# EAGLE design neogeo2tg16_12 (EAGLE 6.6.0)
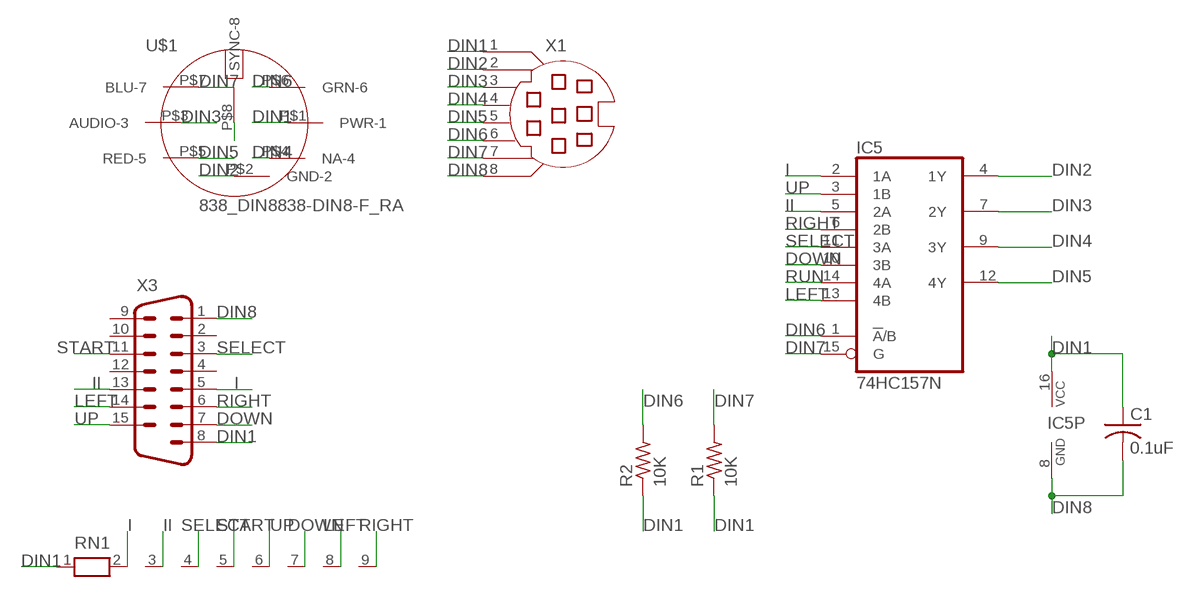
[diagram p0: schematic, sheet 1]

## Parts
C1  0.1uF  C-US025-024X044  [C025-024X044]
IC5  74HC157N  [DIL16]
R1  10K  R-US_0204/7  [0204/7]
R2  10K  R-US_0204/7  [0204/7]
RN1  RN08  [RN-9]
U$1  838_DIN8838-DIN8-F_RA  [838_DIN8]
X1  MD08SS  [MDIN08SS]
X3  M15HP  [M15HP]

## Nets
DIN1: C1.1 IC5.16(VCC) R1.1 R2.1 RN1.1 U$1.P$1(PWR-1) X1.1 X3.8
DIN2: IC5.4(1Y) U$1.P$2(GND-2) X1.2
DIN3: IC5.7(2Y) U$1.P$3(AUDIO-3) X1.3
DIN4: IC5.9(3Y) U$1.P$4(NA-4) X1.4
DIN5: IC5.12(4Y) U$1.P$5(RED-5) X1.5
DIN6: IC5.1(!A!/B) R2.2 U$1.P$6(GRN-6) X1.6
DIN7: IC5.15(G) R1.2 U$1.P$7(BLU-7) X1.7
DIN8: C1.2 IC5.8(GND) U$1.P$8(SYNC-8) X1.8 X3.1
DOWN: IC5.10(3B) RN1.7 X3.7
I: IC5.2(1A) RN1.2 X3.5
II: IC5.5(2A) RN1.3 X3.13
LEFT: IC5.13(4B) RN1.8 X3.14
RIGHT: IC5.6(2B) RN1.9 X3.6
RUN: IC5.14(4A)
SELECT: IC5.11(3A) RN1.4 X3.3
START: RN1.5 X3.11
UP: IC5.3(1B) RN1.6 X3.15
Unconnected: X3.2 X3.4 X3.9 X3.10 X3.12

## Library data of the parts
C1 = rcl:C-US: CAPACITOR, American symbol
IC5 = 74xx-eu:74*157: Quadruple 2-line to 1-line data SELECTOR/MULTIPLEXER
R1 R2 = rcl:R-US_: RESISTOR, American symbol
RN1 = resistor-net:RN08: RESISTOR NETWORK; OC_FARNELL: unknown; OC_NEWARK: unknown
U$1 = 838_Components:838_DIN8
X1 = con-yamaichi:MD08SS: YAMAICHI CONNECTOR; OC_FARNELL: unknown; OC_NEWARK: unknown
X3 = con-subd:M15: SUB-D; OC_FARNELL: unknown; OC_NEWARK: unknown

## Board
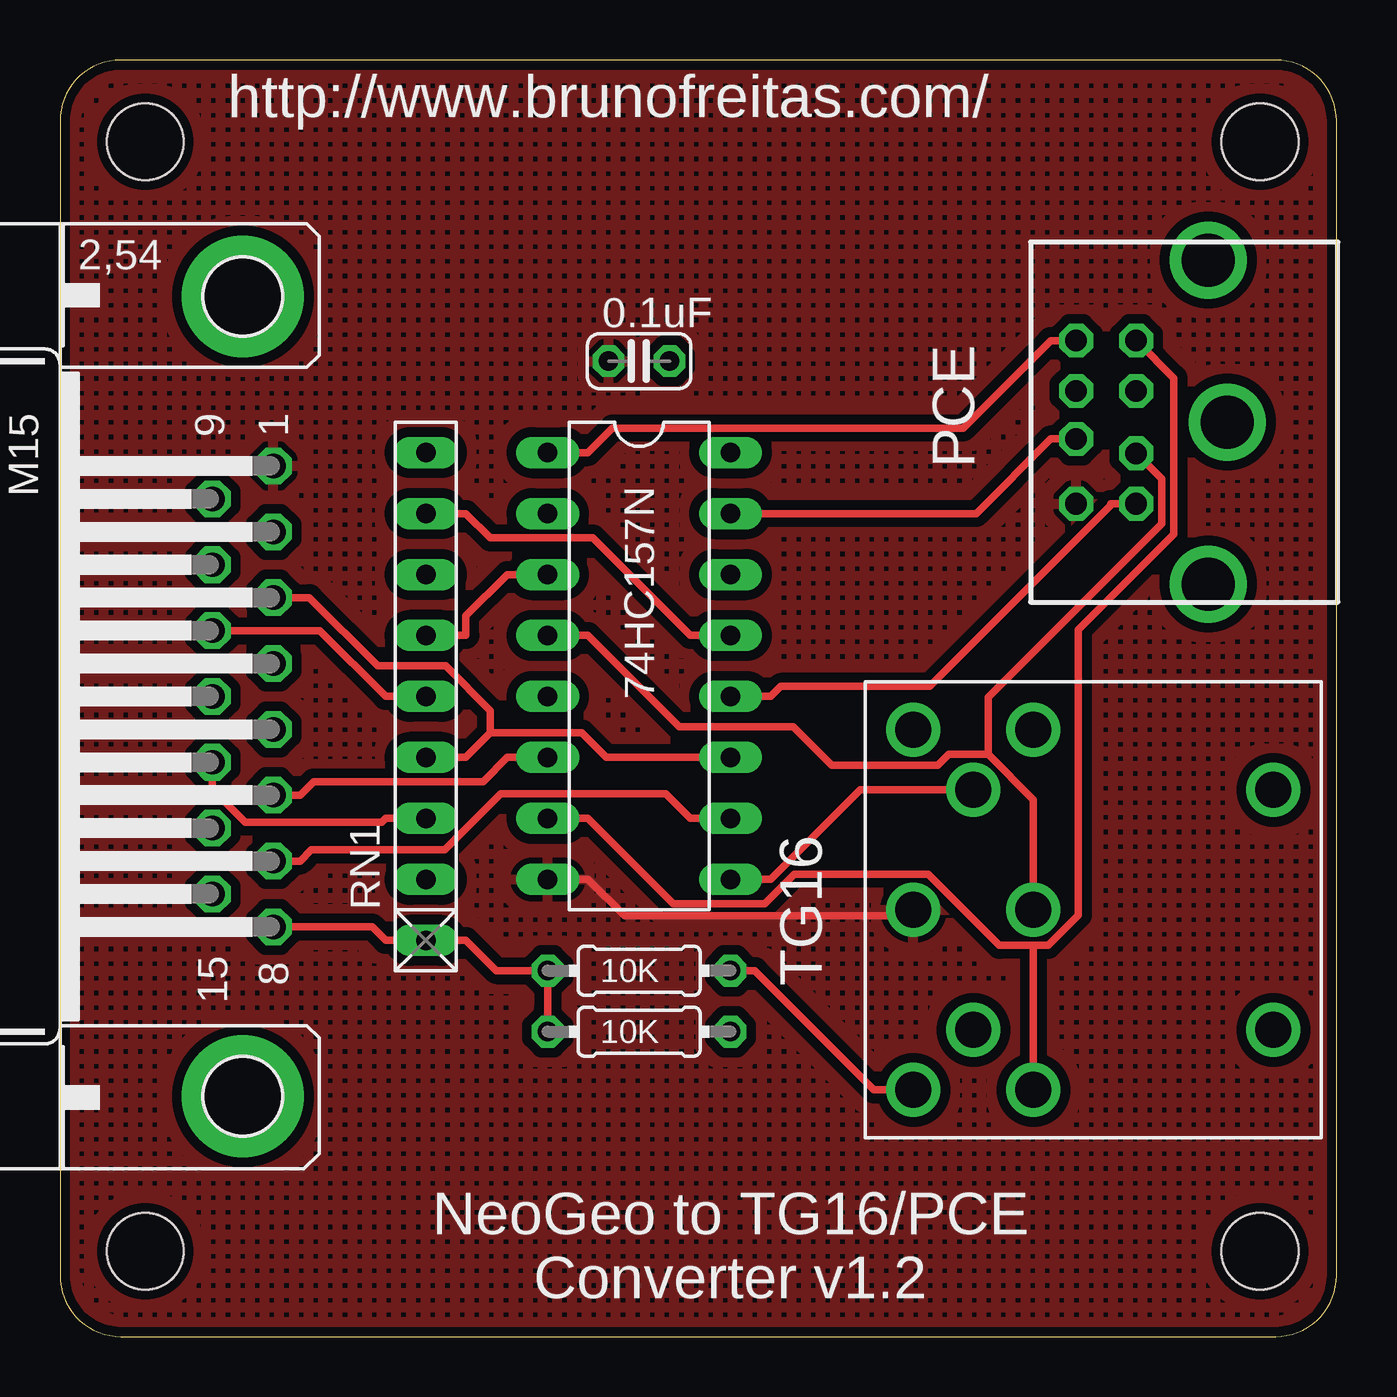
[diagram p1: board, top side]
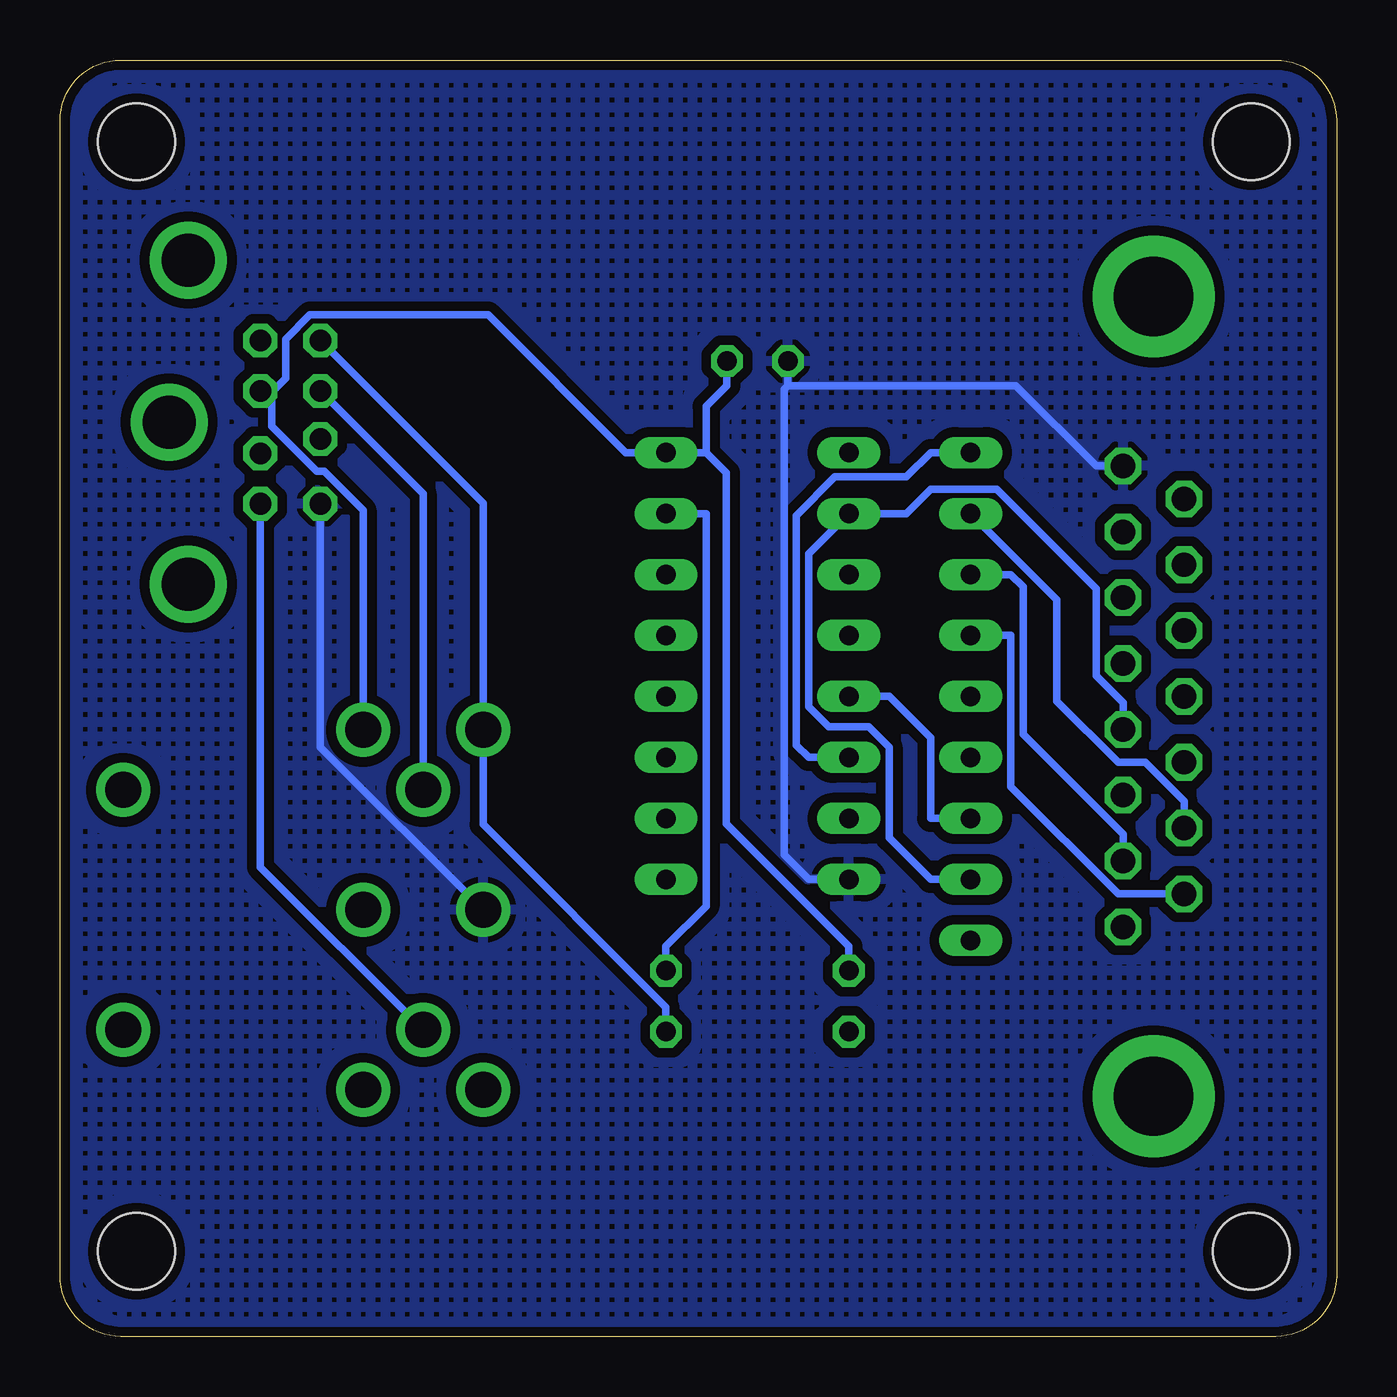
[diagram p2: board, bottom side, seen from below]

Size 53.19 x 53.19 mm. Coordinates in mm from the lower left corner, seen from the top.
Outline: 0,50.65 0,2.54 arc90 2.54,0 50.65,0 arc90 53.19,2.54 53.19,50.65 arc90 50.65,53.19 2.54,53.19 arc90 0,50.65
Copper layers (1*16): Top 0.035mm / dielectric 1.5mm / Bottom 0.035mm
Design rules "SeeedStudio_2layer_DRU_no_angle_20140221": minimum track width 6mil, minimum drill 12mil, track to track 6mil, track to pad 6mil, pad to pad 6mil, via to via 6mil, smd to smd 0mil, copper to edge 10mil, drill to drill 10mil, minimum pad ring 10mil, minimum via ring 6mil, stop-mask expansion 2mil, vias tented up to drill 100mil, thermal gap 10mil
Holes 3.2 mm at 3.56,49.78 3.56,3.56 50,49.78 50,3.56

### Footprints (pad centres in the part's own frame; a part is rotated, then mirrored left to right if it is on the bottom)
C025-024X044 = drill 0.813 octagon: 1 -1.27,0; 2 1.27,0
DIL16 = drill 0.813 long: 1 -8.89,-3.81; 2 -6.35,-3.81; 3 -3.81,-3.81; 4 -1.27,-3.81; 5 1.27,-3.81; 6 3.81,-3.81; 7 6.35,-3.81; 8 8.89,-3.81; 9 8.89,3.81; 10 6.35,3.81; 11 3.81,3.81; 12 1.27,3.81; 13 -1.27,3.81; 14 -3.81,3.81; 15 -6.35,3.81; 16 -8.89,3.81
0204/7 = drill 0.813 octagon: 1 -3.81,0; 2 3.81,0
RN-9 = drill 0.813 long: 1 -10.16,0; 2 -7.62,0; 3 -5.08,0; 4 -2.54,0; 5 0,0; 6 2.54,0; 7 5.08,0; 8 7.62,0; 9 10.16,0
838_DIN8 = drill 1.5: P$1 7.5,-5; P$2 0,-5; P$3 -7.5,-5; P$4 5,-2.5; P$5 -5,-2.5; P$6 7.5,0; P$7 -7.5,0; P$8 0,0; P$9 5,-15; P$10 -5,-15
MDIN08SS = drill 0.9 octagon: 1 1.3,8.5; 2 -1.3,8.5; 3 3.4,8.5; 4 1.3,11; 5 -3.4,8.5; 6 3.4,11; 7 -0.7,11; 8 -3.4,11 | drill 2.2: P$1 -6.75,5.5; P$2 0,4.7; P$3 6.75,5.5
M15HP = drill 1.016 octagon: 1 -9.601,1.27; 2 -6.858,1.27; 3 -4.115,1.27; 4 -1.372,1.27; 5 1.372,1.27; 6 4.115,1.27; 7 6.858,1.27; 8 9.601,1.27; 9 -8.23,-1.27; 10 -5.486,-1.27; 11 -2.743,-1.27; 12 0,-1.27; 13 2.743,-1.27; 14 5.486,-1.27; 15 8.23,-1.27 | drill 3.302 pad 5.08: G1 -16.662,0; G2 16.662,0

### Placement (x,y rotation side)
C1  24.13,40.64 180 top
IC5  24.13,27.94 270 top
R1  24.13,15.24 0 top
R2  24.13,12.7 0 top
RN1  15.24,26.67 90 top
U$1  35.56,17.78 90 top
X1  53.34,38.1 90 top
X3  7.62,26.67 270 top

### Tracks (layer width: path | path; a pad name or v marks a point on that pad's centre or on a via)
DIN1
  Top 0.305: R2.1 20.32,13.72 R1.1 18.19,15.24 16.92,16.51 RN1.1 13.56,16.51 13.01,17.07 X3.8
  Bottom 0.152: X1.1 44.91,39.42 44.78,39.34 | 40.56,25.4 40.64,25.4 U$1.P$1
  Bottom 0.305: 44.37,39.34 44.37,37.93 42.49,36.05 42.19,36.05 40.56,34.42 40.56,25.4 U$1.P$1 | 44.37,39.34 43.78,39.93 43.78,41.56 42.78,42.56 35.35,42.56 29.62,36.83 IC5.16 26.26,36.83 | X1.1 44.78,39.34 44.37,39.34 | 26.26,36.83 25.42,35.99 25.42,21.36 20.32,16.26 R1.1 | 26.26,36.83 26.26,38.76 25.4,39.62 C1.1
DIN2
  Top 0.152: X1.2 44.91,36.78 44.88,36.76 | 40.56,17.88 40.64,17.88 U$1.P$2
  Top 0.305: X1.2 44.88,36.76 45.9,35.74 45.9,33.87 38.67,26.64 38.67,24.26 | 38.67,24.26 37.04,24.26 36.58,23.8 32.15,23.8 30.55,25.4 25.81,25.4 22,29.21 IC5.4 | U$1.P$2 40.56,17.88 40.56,22.37 38.67,24.26
DIN3
  Top 0.152: X1.3 44.91,41.45 44.9,41.44 | 40.56,10.36 40.64,10.36 U$1.P$3
  Top 0.305: 40.56,16.3 39.14,16.3 36.18,19.26 30.59,19.26 29.36,18.03 25.55,18.03 22,21.59 IC5.7 | X1.3 44.9,41.44 46.41,39.93 46.41,33.43 42.44,29.46 42.44,17.56 41.17,16.3 40.56,16.3 | 40.56,16.3 40.56,10.36 U$1.P$3
DIN4
  Top 0.152: U$1.P$4 38,22.76 38,22.78
  Top 0.305: IC5.9 29.62,19.05 33.35,22.78 38,22.78 U$1.P$4
  Bottom 0.152: 38,22.76 U$1.P$4 38,22.76
  Bottom 0.305: X1.4 38.06,35.12 U$1.P$4
DIN5
  Top 0.152: 44.91,34.75 X1.5 44.91,34.75
  Top 0.305: IC5.12 29.62,26.67 30.04,27.09 36.24,27.09 43.78,34.63 43.78,34.7 X1.5
  Bottom 0.152: 38.14,12.86 38.2,12.8 U$1.P$5 | 44.91,34.75 X1.5 44.91,34.75
  Bottom 0.305: X1.5 44.84,19.56 38.14,12.86 U$1.P$5
DIN6
  Top 0.152: X1.6 42.27,41.45 42.27,41.5
  Top 0.305: IC5.1 22,36.83 23.01,37.85 37.63,37.85 41.28,41.5 42.27,41.5 X1.6
  Bottom 0.152: X1.6 42.27,41.45 42.28,41.44 | 35.56,25.2 U$1.P$6
  Bottom 0.305: R2.2 27.94,13.72 35.56,21.34 35.56,25.2 U$1.P$6 | U$1.P$6 | X1.6 42.28,41.44 35.56,34.72 U$1.P$6
DIN7
  Top 0.152: 35.56,10.36 U$1.P$7 35.56,10.36
  Top 0.305: X1.7 41.28,37.4 38.17,34.29 IC5.15 | R1.2 28.96,15.24 33.92,10.28 U$1.P$7
  Bottom 0.305: IC5.15 26.26,34.29 26.26,17.93 27.94,16.26 R1.2
DIN8
  Top 0.305: IC5.8 22,19.05 23.52,17.52 35.3,17.52 U$1.P$8
  Bottom 0.152: 42.27,34.75 X1.8 42.27,34.75
  Bottom 0.305: X3.1 10.01,36.27 13.36,39.62 22.86,39.62 | 22.86,39.62 23.01,39.47 23.01,20.07 22,19.05 IC5.8 | U$1.P$8 42.34,24.56 X1.8 | X1.8 | C1.2 22.86,39.62
  pour Top (isolate 0.406, hatched): 0,53.34 53.34,53.34 53.34,0 0,0
  pour Bottom (isolate 0.406, hatched): 0,53.34 53.34,53.34 53.34,0 0,0
DOWN
  Top 0.305: IC5.10 26.26,21.59 25.25,22.61 18.36,22.61 16.02,20.27 10.47,20.27 10.01,19.81 X3.7
  Bottom 0.305: RN1.7 13.56,31.75 13.06,31.24 13.06,25.09 8.89,20.93 X3.7
I
  Bottom 0.305: X3.5 8.89,26.42 10.01,27.53 10.01,31.16 14.16,35.31 16.92,35.31 17.93,34.29 IC5.2 22,32.61 22,26.25 21.15,25.4 19.49,25.4 18.64,24.55 18.64,20.78 16.92,19.05 RN1.2
II
  Top 0.305: X3.13 6.35,22.81 7.72,21.44 13.41,21.44 13.56,21.59 RN1.3
  Bottom 0.305: RN1.3 16.92,21.59 16.92,24.94 18.64,26.67 IC5.5
LEFT
  Top 0.305: IC5.13 26.26,29.21 22.2,33.27 17.93,33.27 16.92,34.29 RN1.8
  Bottom 0.305: RN1.8 11.65,30.7 11.65,26.48 9.1,23.93 7.98,23.93 6.35,22.3 X3.14
RIGHT
  Top 0.305: IC5.6 18.64,24.13 17.63,23.11 10.57,23.11 10.01,22.55 X3.6
  Bottom 0.305: IC5.6 22,24.13 22.5,24.64 22.5,34.21 20.9,35.81 17.93,35.81 16.92,36.83 RN1.9
SELECT
  Top 0.305: 17.93,25.15 21.74,25.15 22.76,24.13 IC5.11 | 17.93,25.15 16.92,24.13 RN1.4 | X3.3 10.39,30.79 13.23,27.94 16.07,27.94 17.93,26.07 17.93,25.15
START
  Top 0.305: RN1.5 13.56,26.67 10.82,29.41 X3.11
UP
  Top 0.305: RN1.6 16.92,29.21 16.92,30.02 18.64,31.75 IC5.3
  Bottom 0.305: RN1.6 13.56,29.21 13.56,22.9 9.1,18.44 X3.15

### Text on the board
tPlace: http://www.brunofreitas.com/ | PCE | TG16 | NeoGeo to TG16/PCE / Converter v1.2